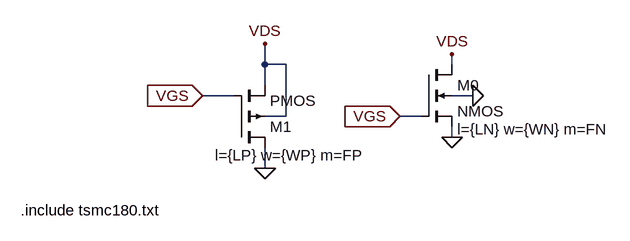
[diagram p0: schematic NMOS_CHART_SETUP_1.asc]
NMOS_CHART_SETUP_1.asc, the LTspice schematic file:
Version 4
SHEET 1 880 680
WIRE -80 96 -80 64
WIRE -48 96 -80 96
WIRE 208 96 208 80
WIRE -80 128 -80 96
WIRE -128 144 -176 144
WIRE 240 144 208 144
WIRE -48 176 -48 96
WIRE -48 176 -80 176
WIRE 160 176 128 176
WIRE 208 208 208 192
WIRE -80 256 -80 224
FLAG 128 176 VGS
IOPIN 128 176 In
FLAG 208 80 VDS
FLAG 208 208 0
FLAG 240 144 0
FLAG -80 64 VDS
FLAG -176 144 VGS
IOPIN -176 144 In
FLAG -80 256 0
SYMBOL nmos4 160 96 R0
WINDOW 123 56 100 Left 2
SYMATTR Value2 l={LN} w={WN} m=FN
SYMATTR InstName M0
SYMBOL pmos4 -128 224 M180
WINDOW 123 -29 -12 Left 2
SYMATTR InstName M1
SYMATTR Value2 l={LP} w={WP} m=FP
TEXT -456 320 Left 2 !.include tsmc180.txt

The netlist it stands for:
* NMOS_CHART_SETUP_1.asc
M0 VDS VGS 0 0 NMOS l={LN} w={WN} m=FN
M1 0 VGS VDS VDS PMOS l={LP} w={WP} m=FP
.model NMOS NMOS
.model PMOS PMOS
.lib standard.mos
.include tsmc180.txt
.backanno
.end